# Altium schematic sheet BaseArduino.SchDoc
size A4
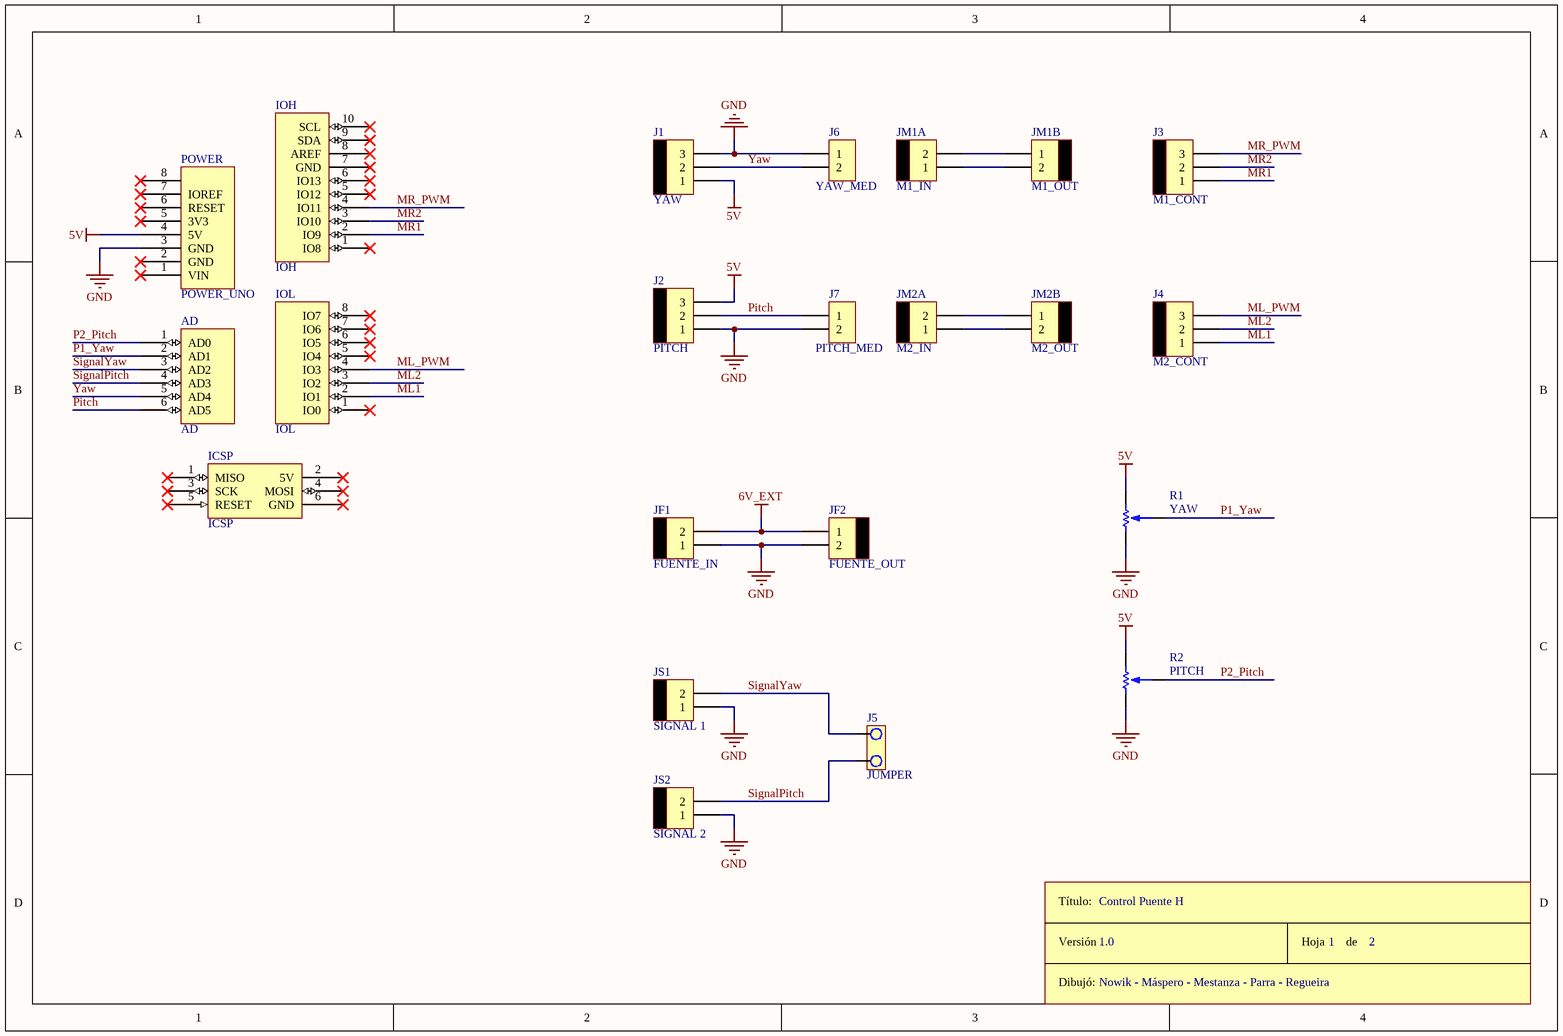
[diagram p0: BaseArduino.SchDoc]

## Parts
AD  AD  [Header 6x1 8.5mm]
ICSP  ICSP  [ICSP]
IOH  IOH  [Header 10x1 8.5mm]
IOL  IOL  [Header 8x1 8.5mm]
J1  YAW  [MOLEX3]
J2  PITCH  [MOLEX3]
J3  M1_CONT  [MOLEX3]
J4  M2_CONT  [MOLEX3]
J5  JUMPER  [JUMPER2]
J6  YAW_MED  [SIP2]
J7  PITCH_MED  [SIP2]
JF1  FUENTE_IN  [MOLEX2]
JF2  FUENTE_OUT  [MOLEX2]
JM1A  M1_IN  [MOLEX2]
JM1B  M1_OUT  [MOLEX2]
JM2A  M2_IN  [MOLEX2]
JM2B  M2_OUT  [MOLEX2]
JS1  SIGNAL 1  [MOLEX2]
JS2  SIGNAL 2  [MOLEX2]
POWER  POWER_UNO  [Header 8x1 8.5mm]
R1  YAW  [POTENCIOMETRO]
R2  PITCH  [POTENCIOMETRO]
ROT1  Rótulo  (value not drawn)

## Nets
5V: J1.1 J2.3 POWER.4(5V) R1.1 R2.1
6V_EXT: JF1.2 JF2.1
GND: J1.3 J2.1 J6.1 J7.2 JF1.1 JF2.2 JS1.1 JS2.1 POWER.3(GND) R1.3 R2.3
ML1: IOL.2(IO1) J4.1
ML2: IOL.3(IO2) J4.2
ML_PWM: IOL.4(IO3) J4.3
MR1: IOH.2(IO9) J3.1
MR2: IOH.3(IO10) J3.2
MR_PWM: IOH.4(IO11) J3.3
P1_Yaw: AD.2(AD1) R1.2
P2_Pitch: AD.1(AD0) R2.2
Pitch: AD.6(AD5) J2.2 J7.1
SignalPitch: AD.4(AD3) J5.1 JS2.2
SignalYaw: AD.3(AD2) J5.2 JS1.2
Yaw: AD.5(AD4) J1.2 J6.2
NetJM1A_1: JM1A.1 JM1B.2
NetJM1A_2: JM1A.2 JM1B.1
NetJM2A_1: JM2A.1 JM2B.2
NetJM2A_2: JM2A.2 JM2B.1

Not connected (* = marked no-connect by the designer): ICSP 1(MISO)* 2(5V)* 3(SCK)* 4(MOSI)* 5(RESET)* 6(GND)*; IOH 1(IO8)* 5(IO12)* 6(IO13)* 7(GND)* 8(AREF)* 9(SDA)* 10(SCL)*; IOL 1(IO0)* 5(IO4)* 6(IO5)* 7(IO6)* 8(IO7)*; POWER 1(VIN)* 2(GND)* 5(3V3)* 6(RESET)* 7(IOREF)* 8*

## Notes on the sheet
- Control Puente H
- 1.0
- Nowik - Máspero - Mestanza - Parra - Regueira
- 1
- 2
- (in symbol Rótulo) Título:; Versión; Hoja       de; Dibujó:

## Library data of the parts
J1-J4 = MOLEX3
J6 J7 = CON2
JF1 JF2 JM1A JM1B JM2A JM2B JS1 JS2 = MOLEX2
R1 R2 = POTENCIOMETRO